# Altium schematic sheet LTC_2949.SchDoc
size A; SheetNumber: 5; SheetTotal: 5
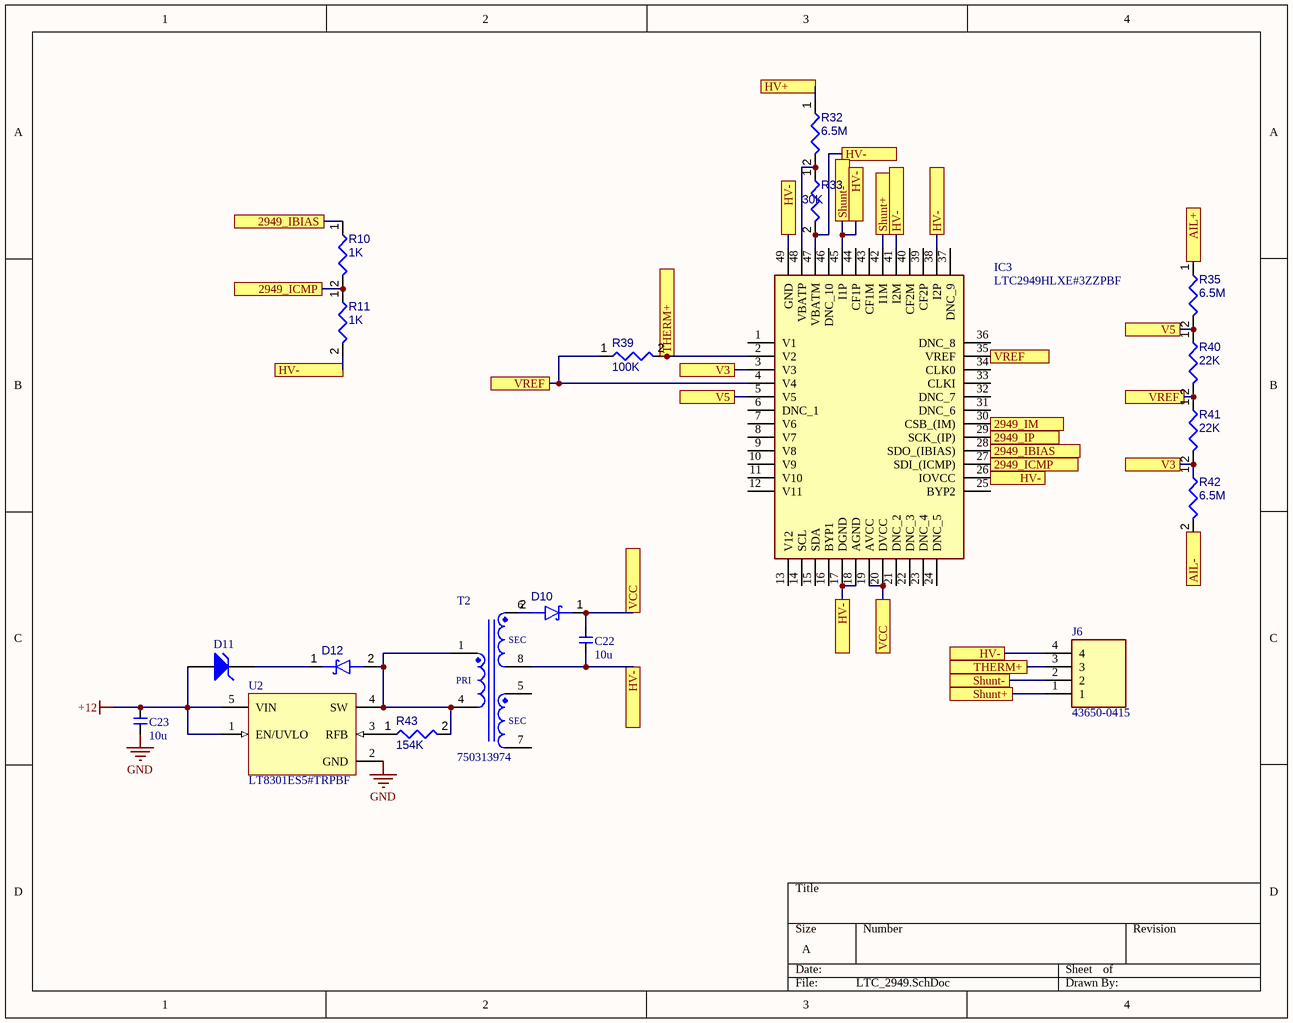
[diagram p0: LTC_2949.SchDoc]

## Parts
C22  10u  [CAP-0603]
C23  10u  [CAP-0603]
D10  (no value)  [MicroSMP (DO-219AD)]
D11  (no value)  [FAIR-DO-35-2]
D12  (no value)  [MicroSMP (DO-219AD)]
IC3  LTC2949HLXE#3ZZPBF  [QFP50P900X900X160-49N]
J6  43650-0415  [43650-04YY_151617]
R10  1K  [RESC0805(2012)_L]
R11  1K  [RESC0805(2012)_L]
R32  6.5M  [RESC0805(2012)_L]
R33  30K  [RESC0805(2012)_L]
R35  6.5M  [RESC0805(2012)_L]
R39  100K  [RESC0805(2012)_L]
R40  22K  [RESC0805(2012)_L]
R41  22K  [RESC0805(2012)_L]
R42  6.5M  [RESC0805(2012)_L]
R43  154K  [RESC0805(2012)_L]
T2  750313974  [WE-FLYLT_EP10_L13.34W15.24H11.43]
U2  LT8301ES5#TRPBF  [LT-S5_N]

## Ports
2949_IBIAS, 2949_ICMP, 2949_IM, 2949_IP, AIL+, AIL-, HV+, HV-, Shunt+, Shunt-, THERM+, V3, V5, VCC, VREF

## Nets
+12: C23.1 D11.1(A) U2.1(EN/UVLO) U2.5(VIN)
GND: C23.2 U2.2(GND)
2949_IBIAS: IC3.28(SDO_(IBIAS)) R10.1 ; port 2949_IBIAS
2949_ICMP: IC3.27(SDI_(ICMP)) R10.2 R11.1 ; port 2949_ICMP
2949_IM: IC3.30(CSB_(IM)) ; port 2949_IM
2949_IP: IC3.29(SCK_(IP)) ; port 2949_IP
AIL+: R35.1 ; port AIL+
AIL-: R42.2 ; port AIL-
HV+: R32.1 ; port HV+
HV-: C22.2 IC3.17(DGND) IC3.18(AGND) IC3.26(IOVCC) IC3.38(I2P) IC3.41(I2M) IC3.45(I1P) IC3.47(VBATM) IC3.49(GND) J6.2 J6.4 R11.2 R33.2 T2.8 ; port HV-, port Shunt-
Shunt+: IC3.42(I1M) J6.1 ; port Shunt+
THERM+: IC3.2(V2) J6.3 R39.2 ; port THERM+
V3: IC3.3(V3) R41.2 R42.1 ; port V3
V5: IC3.5(V5) R35.2 R40.1 ; port V5
VCC: C22.1 D10.1(K) IC3.19(AVCC) IC3.20(DVCC) ; port VCC
VREF: IC3.4(V4) IC3.35(VREF) R39.1 R40.2 R41.1 ; port VREF
NetD10_2: D10.2(A) T2.6
NetD11_2: D11.2(K) D12.1(K)
NetD12_2: D12.2(A) R43.2 T2.1 T2.4 U2.4(SW)
NetIC3_48: IC3.48(VBATP) R32.2 R33.1
NetR43_1: R43.1 U2.3(RFB)

Not connected (* = marked no-connect by the designer): IC3 1(V1) 6(DNC_1) 7(V6) 8(V7) 9(V8) 10(V9) 11(V10) 12(V11) 13(V12) 14(SCL) 15(SDA) 16(BYP1) 21(DNC_2) 22(DNC_3) 23(DNC_4) 24(DNC_5) 25(BYP2) 31(DNC_6) 32(DNC_7) 33(CLKI) 34(CLK0) 36(DNC_8) 37(DNC_9) 39(CF2P) 40(CF2M) 43(CF1M) 44(CF1P) 46(DNC_10); T2 5 7

## Notes on the sheet
- (in symbol CMP-09294-49417564-1) SEC; PRI

## Library data of the parts
C22 C23 = CMP-050-000018-1: Design Item ID: CAP-0603; Source: ife19_Elec_Library.SchLib
D10 D12 = CMP-014-000027-1: DIODE SCHOTTKY 30V 100MA VMN2M; Mounting Technology: SMT; Case/Package: SMD/SMT; Pins: 2; Source: Integrated_Library - 12.03.21 - 15.39.SchLib; Design Item ID: CMP-004-00028-2
D11 = CMP-014-000021-1: Manufacturer: Fairchild Semiconductor; Power: 500mW; Impedance: 90Ohm; Forward Voltage: 1.5V; Package Quantity: 1000; Mounting Technology: TH; Design Item ID: CMP-004-00021-1; Pins: 2; Case/Package: DO-35-2; Packaging: Bulk; Source: Integrated_Library - 12.03.21 - 15.39.SchLib
IC3 = LTC2949HLXE#3ZZPBF: Integrated Circuit; Manufacturer_Name: Analog Devices; Datasheet Link: https://www.analog.com/media/en/technical-documentation/data-sheets/LTC2949.pdf; Height: 1.6mm; Manufacturer_Part_Number: LTC2949HLXE#3ZZPBF; Mouser Part Number: 584-949HLXE#3ZZPBF; Mouser Price/Stock: https://www.mouser.co.uk/ProductDetail/Analog-Devices/LTC2949HLXE3ZZPBF?qs=wnTfsH77Xs63l8yDYlqztA%3D%3D; Arrow Part Number: LTC2949HLXE#3ZZPBF; Arrow Price/Stock: https://www.arrow.com/en/products/ltc2949hlxe3zzpbf/analog-devices?region=nac
J6 = 43650-0415: Connector; Manufacturer_Name: Molex; Datasheet Link: https://www.molex.com/pdm_docs/sd/436500215_sd.pdf; Height: 9.9mm; Manufacturer_Part_Number: 43650-0415; Mouser Part Number: 538-43650-0415; Mouser Price/Stock: https://www.mouser.co.uk/ProductDetail/Molex/43650-0415?qs=GEJyObWCoZgrB2DNhHHwDQ%3D%3D
R10 R11 R32 R33 R35 R39-R43 = CMP-009-000150-1: Chip Resistor, 43,2 kOhms, +/-1 %, 63 mW, -55 to 155 degC, 0402; Available Preview Images: 2D; Source: Integrated_Library - 12.03.21 - 15.39.SchLib; Design Item ID: CMP-009-00154-2
T2 = CMP-09294-49417564-1: 750313974 Trans Flyback LT8301; Max DC Current: 2A; Frequency: 300kHz; DC Resistance (DCR): 80mΩ; Inductance: 40µH; Shielding: Shielded; Packaging: Cut Tape (CT); Height - Seated (Max): 11.43mm; NexarPartId: 49417564; Height: 11.43mm; Mount: Surface Mount; Termination: SMD/SMT; RoHS: Compliant; Width: 13.34mm; Current Rating: 2A; Length: 15.24mm
U2 = CMP-0492-02674-1: Micropower No-Opto Isolated Flyback Converter with 65 V / 1.2 A Switch, 2.7 to 42 V, -40 to 125 degC, 5-Pin SOT23 (S5), RoHS, Tape and Reel; Manufacturer: Linear Technology; fMIN: 10 kHz Typ.; ISW (MAX): 1.375 A Typ.; RDS(ON): 0.4 Ohm Typ.; tON (MIN): 170 ns Typ.; RoHS: TRUE; ComponentLink2URL: http://cds.linear.com/docs/en/datasheet/8301f.pdf; Packing: Tape and Reel; ComponentLink3URL: http://cds.linear.com/docs/en/packaging/SOT_5_05-08-1635.pdf; PackageDescription: 5-Pin Small Out-Line Transistor, Body 2.9 x 1.625 mm, Pitch 0.95 mm; ComponentLink1Description: Manufacturer URL; Mounting Technology: Surface Mount; DatasheetVersion: 02/2014; ComponentLink2Description: Datasheet; ComponentLink3Description: Package Specification; VIN: 2.7 to 42 V; PartNumber: LT8301ES5#TRPBF; PackageVersion: 06/2010; Temperature Range: -40 to 125 degC; ComponentLink1URL: http://www.linear.com/